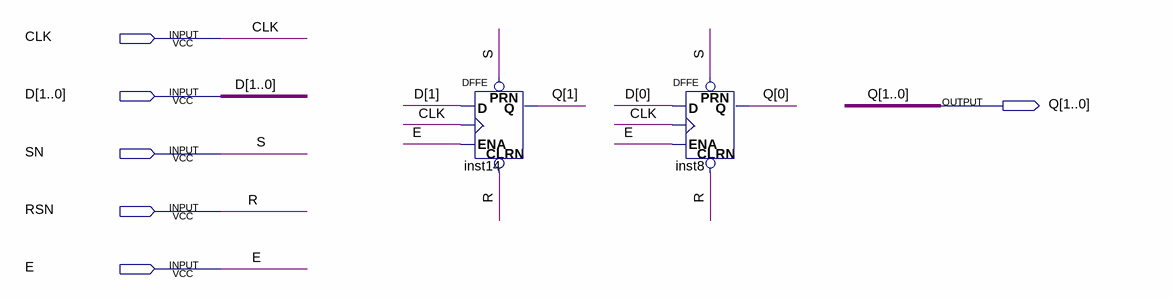
[diagram p0: schematic sheet]
// Quartus schematic REGISTER_2BIT.bdf as structural Verilog: 2 symbols, 6 pins
module REGISTER_2BIT (
  input  CLK,
  input  [1:0] D,
  input  SN,
  input  RSN,
  input  E,
  output [1:0] Q
);

  DFFE inst14 (.PRN(SN), .CLRN(RSN), .D(D[1]), .CLK(CLK), .ENA(E), .Q(Q[1]));
  DFFE inst8 (.PRN(SN), .CLRN(RSN), .D(D[0]), .CLK(CLK), .ENA(E), .Q(Q[0]));

  // Other names for the same wires on the sheet: R = RSN; S = SN
endmodule
